# EAGLE schematic CONECTOR__PULSE-611_V1 (EAGLE 9.5.1)
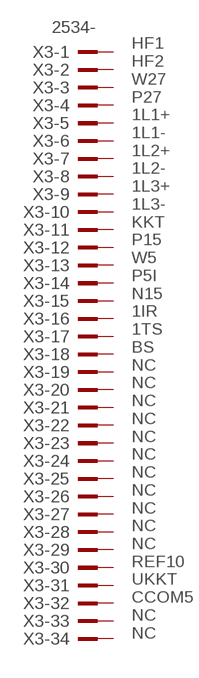
[diagram p0: schematic, sheet 1]

## Parts
X3  2534-  [PAK100/2500-34]
Unconnected: X3.1 X3.2 X3.3 X3.4 X3.5 X3.6 X3.7 X3.8 X3.9 X3.10 X3.11 X3.12 X3.13 X3.14 X3.15 X3.16 X3.17 X3.18 X3.19 X3.20 X3.21 X3.22 X3.23 X3.24 X3.25 X3.26 X3.27 X3.28 X3.29 X3.30 X3.31 X3.32 X3.33 X3.34

## Notes on the sheet
- HF1
  HF2
  W27
  P27
  1L1+
  1L1-
  1L2+
  1L2-
  1L3+
  1L3-
  KKT
  P15
  W5
  P5I
  N15
  1IR
  1TS
  BS
  NC
  NC
  NC
  NC
  NC
  NC
  NC
  NC
  NC
  NC
  NC
  REF10
  UKKT
  CCOM5
  NC
  NC

## Library data of the parts
X3 = con-3m:2534-: 3M (TM) Pak 100 4-Wall Header Source: 3M; OC_FARNELL: unknown; OC_NEWARK: unknown